# Altium schematic sheet Buck_60W20V_Power_Section.SchDoc
size A4; SheetNumber: 2; SheetTotal: 5
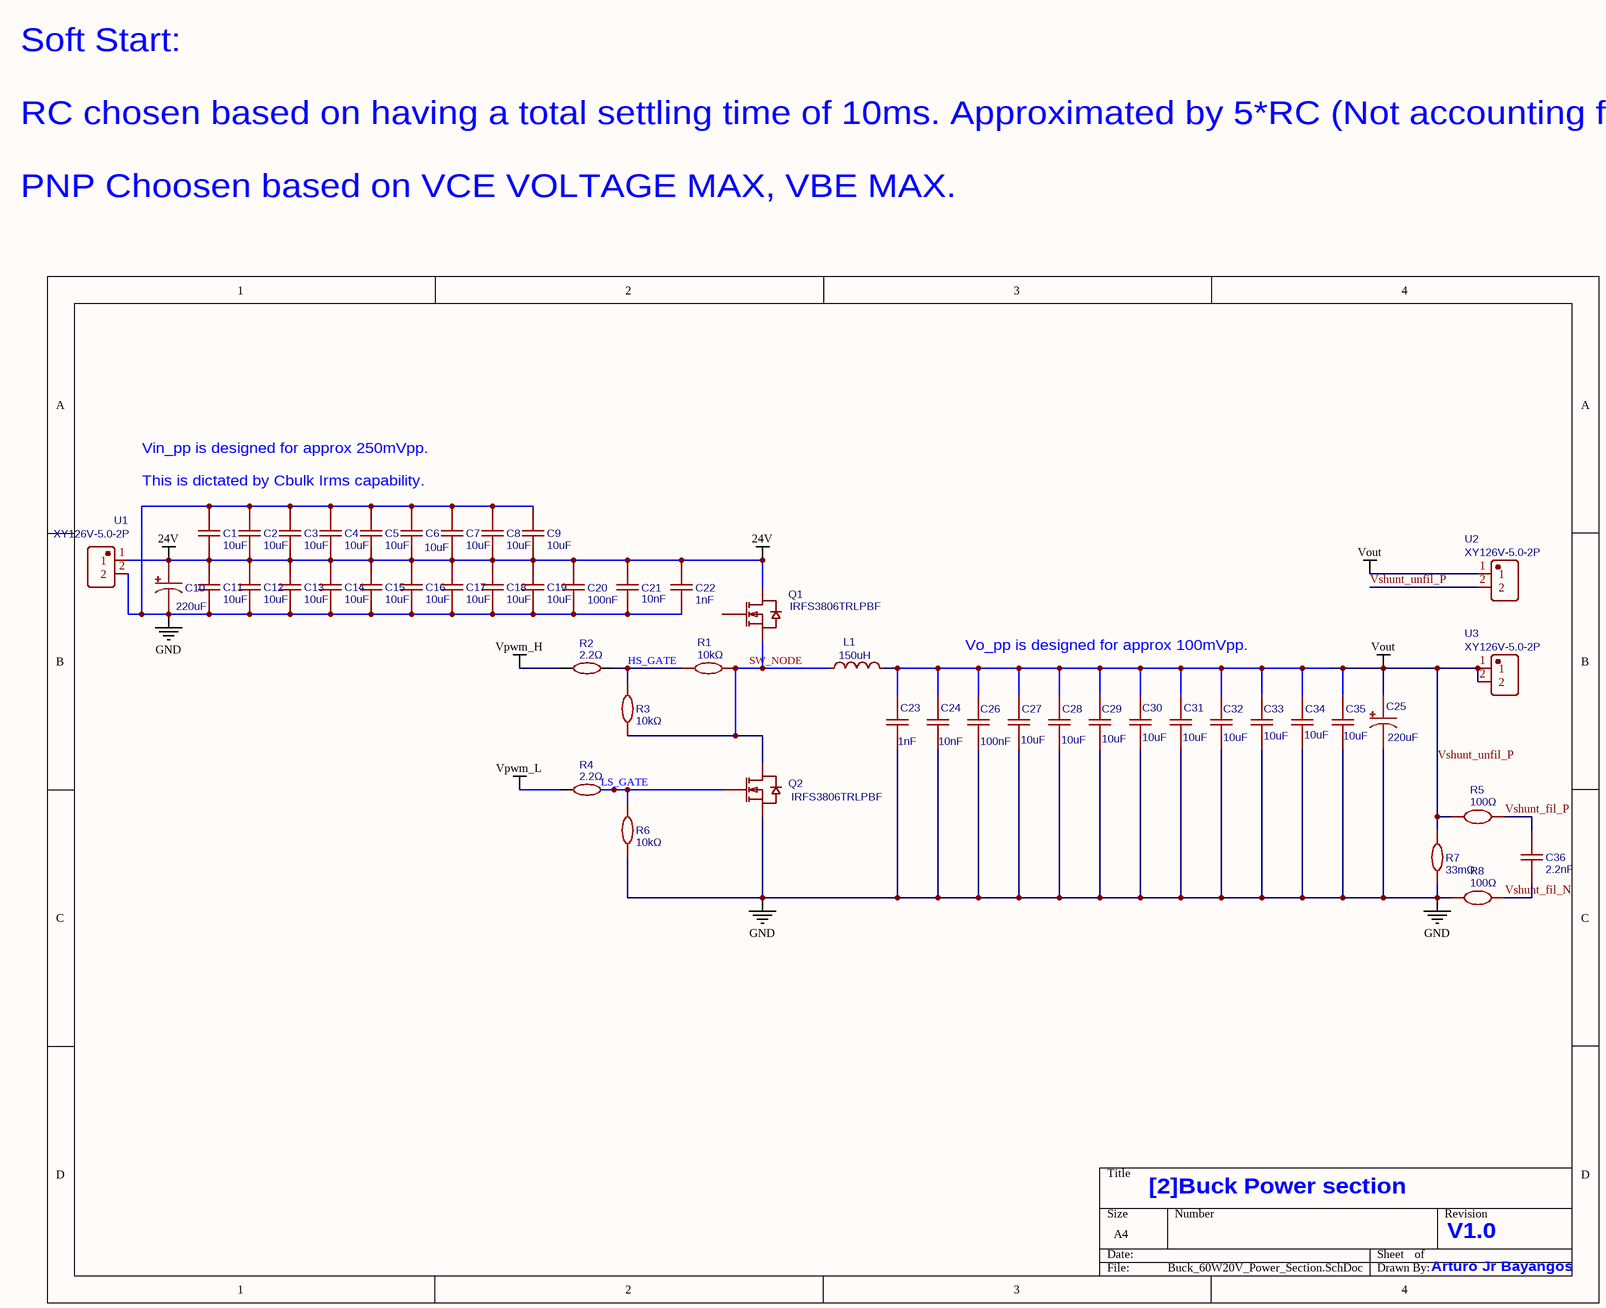
[diagram p0: Buck_60W20V_Power_Section.SchDoc]

## Parts
C1  10uF  [C1210]
C2  10uF  [C1210]
C3  10uF  [C1210]
C4  10uF  [C1210]
C5  10uF  [C1210]
C6  10uF  [C1210]
C7  10uF  [C1210]
C8  10uF  [C1210]
C9  10uF  [C1210]
C10  220uF  [CAP-SMD_BD10.0-L10.3-W10.3-LS11.3-FD]
C11  10uF  [C1210]
C12  10uF  [C1210]
C13  10uF  [C1210]
C14  10uF  [C1210]
C15  10uF  [C1210]
C16  10uF  [C1210]
C17  10uF  [C1210]
C18  10uF  [C1210]
C19  10uF  [C1210]
C20  100nF  [C0402]
C21  10nF  [C0402]
C22  1nF  [C0402]
C23  1nF  [C0402]
C24  10nF  [C0402]
C25  220uF  [CAP-SMD_BD10.0-L10.3-W10.3-LS11.3-FD]
C26  100nF  [C0402]
C27  10uF  [C1210]
C28  10uF  [C1210]
C29  10uF  [C1210]
C30  10uF  [C1210]
C31  10uF  [C1210]
C32  10uF  [C1210]
C33  10uF  [C1210]
C34  10uF  [C1210]
C35  10uF  [C1210]
C36  2.2nF  [C0603]
L1  150uH  [BUCK_INDUCTOR]
Q1  IRFS3806TRLPBF  [D2PAK_L9.1-W10.0-P2.54-LS15.3-BR-1]
Q2  IRFS3806TRLPBF  [D2PAK_L9.1-W10.0-P2.54-LS15.3-BR-1]
R1  10kΩ  [R0603]
R2  2.2Ω  [R0603]
R3  10kΩ  [R0603]
R4  2.2Ω  [R0603]
R5  100Ω  [R0603]
R6  10kΩ  [R0603]
R7  33mΩ  [R1210]
R8  100Ω  [R0603]
U1  XY126V-5.0-2P  [CONN-TH_XY126V-5.0-2P]
U2  XY126V-5.0-2P  [CONN-TH_XY126V-5.0-2P]
U3  XY126V-5.0-2P  [CONN-TH_XY126V-5.0-2P]

## Nets
24V: C1.1 C2.1 C3.1 C4.1 C5.1 C6.1 C7.1 C8.1 C9.1 C10.1 C11.2 C12.2 C13.2 C14.2 C15.2 C16.2 C17.2 C18.2 C19.2 C20.2 C21.2 C22.2 Q1.4(D) U1.1
GND: C1.2 C2.2 C3.2 C4.2 C5.2 C6.2 C7.2 C8.2 C9.2 C10.2 C11.1 C12.1 C13.1 C14.1 C15.1 C16.1 C17.1 C18.1 C19.1 C20.1 C21.1 C22.1 C23.1 C24.1 C25.2 C26.1 C27.1 C28.1 C29.1 C30.1 C31.1 C32.1 C33.1 C34.1 C35.1 Q2.3(S) R6.1 R7.1 R8.1 U1.2
Vpwm_H: R2.1
Vpwm_L: R4.1
Vshunt_unfil_P: C23.2 C24.2 C25.1 C26.2 C27.2 C28.2 C29.2 C30.2 C31.2 C32.2 C33.2 C34.2 C35.2 L1.2 R5.1 R7.2 U2.1 U2.2 U3.1 U3.2  [also labelled Vout]
HS_GATE: R1.2 R2.2 R3.2
LS_GATE: Q2.1(G) R4.2 R6.2
SW_NODE: L1.1 Q1.3(S) Q2.4(D) R1.1 R3.1
Vshunt_fil_N: C36.1 R8.2
Vshunt_fil_P: C36.2 R5.2

Not connected (* = marked no-connect by the designer): Q1 1(G)

## Notes on the sheet
- Soft Start:
  RC chosen based on having a total settling time of 10ms. Approximated by 5*RC (Not accounting for the current that the UC3843 will provide).
  PNP Choosen based on VCE VOLTAGE MAX, VBE MAX.
- Vin_pp is designed for approx 250mVpp.
  This is dictated by Cbulk Irms capability.
- Vo_pp is designed for approx 100mVpp.
- [2]Buck Power section
- V1.0
- Arturo Jr Bayangos

## Library data of the parts
C1-C9 C11-C19 C27-C35 = 10uF: Manufacturer: TAIYO YUDEN(太诱); Manufacturer Part: UMK325AB7106KM-T; nameAlias: Capacitance; Contributor: LCSC; Supplier: LCSC; Supplier Part: C386167; JLCPCB Part Class: Extended Part; spicePre: C; spiceSymbolName: UMK325AB7106KM-T
C10 C25 = 220uF: Manufacturer: Nichicon(尼吉康); Manufacturer Part: UUD1H221MNL1GS; nameAlias: Capacitance; Contributor: LCSC; Supplier: LCSC; Supplier Part: C125976; JLCPCB Part Class: Extended Part; spicePre: C; spiceSymbolName: UUD1H221MNL1GS
C20 C26 = 100nF: Manufacturer: TAIYO YUDEN(太诱); Manufacturer Part: UMK105B7104KV-FR; nameAlias: Capacitance; Contributor: lcsc; Supplier: LCSC; Supplier Part: C2167491; JLCPCB Part Class: Extended Part; spicePre: C; spiceSymbolName: UMK105B7104KV-FR
C21 C24 = 10nF: Manufacturer: TAIYO YUDEN(太诱); Manufacturer Part: UMF105B7103KVHF; nameAlias: Capacitance; Contributor: LCSC; Supplier: LCSC; Supplier Part: C386105; JLCPCB Part Class: Extended Part; spicePre: C; spiceSymbolName: UMF105B7103KVHF
C22 C23 = 1nF: Manufacturer: TAIYO YUDEN(太诱); Manufacturer Part: UMF105B7102KVHF; nameAlias: Capacitance; Contributor: LCSC; Supplier: LCSC; Supplier Part: C386104; JLCPCB Part Class: Extended Part; spicePre: C; spiceSymbolName: UMF105B7102KVHF
C36 = 2.2nF: Manufacturer: TDK; Manufacturer Part: C1608C0G2E222JT000N; Contributor: LCSC; nameAlias: Capacitance; Supplier: LCSC; Supplier Part: C694281; JLCPCB Part Class: Extended Part; spicePre: C; spiceSymbolName: C1608C0G2E222JT000N
L1 = 150uH: nameAlias: Value(H); Contributor: LCEDA_Lib; Package Display: No; Supplier: Digi-Key; spicePre: L; spiceSymbolName: L_AXIAL-0.5_US
Q1 Q2 = IRFS3806TRLPBF: Manufacturer: Infineon(英飞凌); Contributor: LCSC; Supplier: LCSC; Supplier Part: C538013; Manufacturer Part: IRFS3806TRLPBF; JLCPCB Part Class: Extended Part; spicePre: Q; spiceSymbolName: IRFS3806TRLPBF
R1 R3 R6 = 10kΩ: Manufacturer: Viking(光颉); Manufacturer Part: ARG03BTC1002; Resistance (Ohms): 10K; nameAlias: Resistance; Contributor: LCSC; Supplier: LCSC; Supplier Part: C309083; JLCPCB Part Class: Extended Part; spicePre: R; spiceSymbolName: ARG03BTC1002
R2 R4 = 2.2Ω: Manufacturer: UNI-ROYAL(厚声); Manufacturer Part: 0603WAJ022JT5E; nameAlias: Resistance; Resistance (Ohms): 2.2; Supplier: LCSC; Supplier Part: C25226; JLCPCB Part Class: Extended Part; spicePre: R; spiceSymbolName: 0603WAJ022JT5E
R5 R8 = 100Ω: Manufacturer: YAGEO(国巨); Manufacturer Part: RT0603CRE07100RL; Contributor: LCSC; Supplier: LCSC; Supplier Part: C705906; Resistance: 100Ω; JLCPCB Part Class: Extended Part; spicePre: R; spiceSymbolName: RT0603CRE07100RL
R7 = 33mΩ: Manufacturer: RALEC(旺诠); Manufacturer Part: RTT12R033FTP; Resistance (Ohms): 0.033; nameAlias: Resistance; Contributor: LCSC; Supplier: LCSC; Supplier Part: C159305; JLCPCB Part Class: Extended Part; spicePre: R; spiceSymbolName: RTT12R033FTP
U1-U3 = XY126V-5.0-2P: Manufacturer: XINLAIYA(新莱亚); Contributor: LCSC; Supplier: LCSC; Supplier Part: C557646; Manufacturer Part: XY126V-5.0-2P; JLCPCB Part Class: Extended Part; spicePre: U; spiceSymbolName: XY126V-5.0-2P